# Altium schematic sheet ps.SchDoc
size A
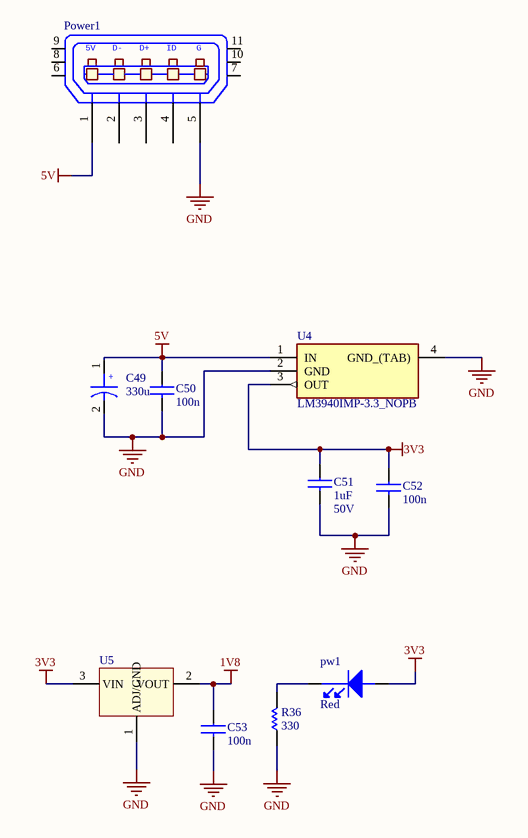
[diagram p0: ps.SchDoc]

## Parts
C49  330u  [C2917]
C50  100n  [C0402]
C51  1uF  Voltage - Rated: 50V  [C0805]
C52  100n  [C0402]
C53  100n  [C0402]
Power1  USB MICRO AB  [USB_Micro_AB]  (value not drawn)
pw1  Red  [LED_0603]
R36  330  [RES 1206]
U4  LM3940IMP-3.3_NOPB  [SOT230P700X180-4N]
U5  AMS1117  [AMS1117]  (value not drawn)

## Nets
1V8: C53.1 U5.2(VOUT)
3V3: C51.1 C52.1 pw1.2(ANODE) U4.3(OUT) U5.3(VIN)
5V: C49.1 C50.1 Power1.1(P1) U4.1(IN)
GND: C49.2 C50.2 C51.2 C52.2 C53.2 Power1.5(P5) R36.1 U4.2(GND) U4.4(GND_(TAB)) U5.1(ADJ/GND)
Netpw1_1: pw1.1(cathode) R36.2

Not connected (* = marked no-connect by the designer): Power1 2(P2) 3(P3) 4(P4) 6 7 8 9 10 11

## Notes on the sheet
- (in symbol 0475890001) 5V; D-; D+; ID; G
- (in symbol T495D337K010ATE150) +

## Library data of the parts
C49 = T495D337K010ATE150: CAP TANT 330UF 10V 10% 2917; Manufacturer: Kemet; Manufacturer Size Code: D; Capacitance: 330µF; ESR (Equivalent Series Resistance): 150 mOhm; Type: Molded; .Creator: MM; .Checked SCH: RF, used by MM; Supplier 1: Digi-Key; Manufacturer Part Number: T495D337K010ATE150; RoHS: RoHS Compliant; Category: Capacitors; Stock 1: 272; Pricing 1: 1=1.84, 10=1.455, 50=1.2612, 100=1.0915, 250=0.9702 (USD); Packaging: Cut Tape (CT); Voltage - Rated: 10V; Tolerance: ±10%; Operating Temperature: -55°C ~ 125°C; Mounting Type: Surface Mount; Package / Case: 2917 (7343 Metric); Size / Dimension: 0.287" L x 0.169" W (7.30mm x 4.30mm); Height - Seated (Max): 0.122" (3.10mm); Lead Spacing: -; Features: General Purpose; Lifetime @ Temp.: -; ComponentLink1URL: http://www.kemet.com/kemet/web/homepage/kechome.nsf/vapubfiles/KEM_T2009_T495.pdf/$file/KEM_T2009_T495.pdf; ComponentLink1Description: http://www.kemet.com/kemet/web/homepage/kechome.nsf/vapubfiles/KEM_T2009_T495.pdf/$file/KEM_T2009_T495.pdf; Supplier Part Number 1: 399-10511-1-ND; .Checked PCB: MM
C50 C52 C53 = C1005X5R1H104K: CAP CER .10UF 50V X5R 10% 0402; Manufacturer: TDK Corporation; Capacitance: 0.1µF; Value: 100nF; .Checked PCB: used; Category: Capacitors; Supplier Part Number: 445-5942-1-ND; Manufacturer Part Number: C1005X5R1H104K; Operating Temperature: -55°C ~ 85°C; Package / Case: 0402 (1005 Metric); Price 1k [$]: 0.02340; .Checked SCH: used; Voltage - Rated: 50V; Supplier: Digikey; Supplier 1: Digi-Key; Supplier Part Number 1: 445-5942-1-ND; RoHS: RoHS Compliant; Stock 1: 106926; Pricing 1: 1=0.27, 10=0.18, 100=0.072, 250=0.05176, 500=0.0369, 1000=0.027 (USD); Tolerance: ±10%; Temperature Coefficient: X5R; Mounting Type: Surface Mount, MLCC; Applications: General Purpose; Ratings: -; Size / Dimension: 0.039" L x 0.020" W (1.00mm x 0.50mm); Height - Seated (Max): -; Thickness (Max): 0.022" (0.55mm); Lead Spacing: -; Features: -; Packaging: Cut Tape (CT); Lead Style: -; ComponentLink1URL: http://www.tdk.co.jp/tefe02/e412_c.pdf; ComponentLink1Description: http://www.tdk.co.jp/tefe02/e412_c.pdf
C51 = GRM21BR71H105KA12L: CAP CER 1UF 50V X7R 0805; Manufacturer: Murata Electronics North America; Capacitance: 1.0µF; .Checked PCB: used; Tolerance: ±10%; Category: Capacitors; Manufacturer Part Number: GRM21BR71H105KA12L; Operating Temperature: -55°C ~ 125°C; Package / Case: 0805 (2012 Metric); Price 1k [$]: 0.1359; Value: 1uF; .Checked SCH: used; Supplier Part Number: 490-4736-1-ND; Supplier: Digikey; Supplier 1: Digi-Key; Supplier Part Number 1: 490-4736-1-ND; RoHS: RoHS Compliant; Stock 1: 422791; Pricing 1: 1=0.28, 10=0.254, 25=0.226, 50=0.1978, 100=0.1836, 250=0.16952, 500=0.16102, 750=0.14691, 1000=0.12995 (USD); Temperature Coefficient: X7R; Mounting Type: Surface Mount, MLCC; Applications: General Purpose; Ratings: -; Size / Dimension: 0.079" L x 0.049" W (2.00mm x 1.25mm); Height - Seated (Max): -; Thickness (Max): 0.053" (1.35mm); Lead Spacing: -; Features: -; Packaging: Cut Tape (CT); Lead Style: -; ComponentLink1URL: http://search.murata.co.jp/Ceramy/image/img/PDF/ENG/GRM21BR71H105KA12.pdf; ComponentLink1Description: http://search.murata.co.jp/Ceramy/image/img/PDF/ENG/GRM21BR71H105KA12.pdf
Power1 = 0475890001: CONN RCPT MICRO USB AB R/A SMD; Manufacturer: Molex Inc; Connector Type: USB - micro AB; Number of Contacts: 5; Gender: Receptacle; .Creator: MM; Supplier 1: Digi-Key; Manufacturer Part Number: 0475890001; RoHS: RoHS Compliant; Category: Connectors, Interconnects; Stock 1: 12754; Pricing 1: 1=0.81, 10=0.764, 25=0.6872, 50=0.6108, 100=0.5854, 250=0.53452, 500=0.50908 (USD); Packaging: Cut Tape (CT); Specifications: -; Mounting Type: Surface Mount, Right Angle, Horizontal; Features: Board Guide, Shielded; Ingress Protection: -; ComponentLink1URL: http://www.molex.com/pdm_docs/sd/475890001_sd.pdf; ComponentLink1Description: http://www.molex.com/pdm_docs/sd/475890001_sd.pdf; Supplier Part Number 1: WM17143CT-ND; .Checked PCB: MM; .Checked SCH: MM
pw1 = LS L29K-H1J2-1-Z: LED SMARTLED RED 630NM 0603 SMD; Manufacturer: OSRAM Opto Semiconductors Inc; Millicandela Rating: 4.95mcd; Voltage - Forward (Vf) Typ: 1.8V; Current - Test: 2mA; Wavelength - Peak: 643nm; Viewing Angle: 160°; Lens Type: Diffused; Lens Style/Size: Rectangle with Flat Top, 1.3mm x 0.8mm; Luminous Flux @ Current - Test: 20 mlm; .Checked PCB: RF; Supplier 1: Digi-Key; Supplier Part Number 1: 475-1195-1-ND; Manufacturer Part Number: LS L29K-H1J2-1-Z; RoHS: RoHS Compliant; Category: Optoelectronics; Stock 1: 71670; Pricing 1: 1=0.16, 10=0.137, 100=0.1093, 250=0.09564, 500=0.08744 (USD); Color: Red; Wavelength - Dominant: 630nm; Package / Case: 0603 (1608 Metric); Size / Dimension: 1.70mm L x 0.80mm W; Height: 0.65mm; Mounting Type: Surface Mount; Packaging: Cut Tape (CT); ComponentLink1URL: http://catalog.osram-os.com/catalogue/catalogue.do;jsessionid=DB7CFDBAC5AF1E216E45F622E867085A?act=downloadFile&favOid=020000010003f9de000100b6; ComponentLink1Description: http://catalog.osram-os.com/catalogue/catalogue.do;jsessionid=DB7CFDBAC5AF1E216E45F622E867085A?act=downloadFile&favOid=020000010003f9de000100b6; .Checked SCH: RF
R36 = RESISTOR: value: 330
U4 = LM3940IMP-3.3_NOPB: Integrated Circuit; Manufacturer_Name: Texas Instruments; Manufacturer_Part_Number: LM3940IMP-3.3/NOPB; Datasheet Link: http://www.ti.com/lit/ds/symlink/lm3940.pdf; Height: 1.8mm; Mouser Part Number: 926-LM3940IMP3.3NOPB; Mouser Price/Stock: https://www.mouser.com/Search/Refine.aspx?Keyword=926-LM3940IMP3.3NOPB; RS Part Number: 5361546P; RS Price/Stock: http://uk.rs-online.com/web/p/products/5361546P
U5 = AMS1117: SOT-223-3 3V3 Regulator